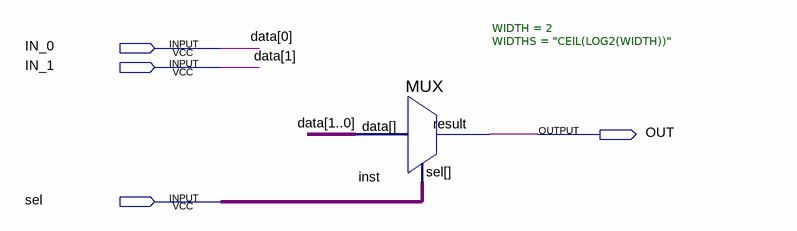
[diagram p0: schematic sheet]
// Quartus schematic mux2x1.bdf as structural Verilog: 1 symbols, 4 pins
module mux2x1 (
  input  IN_0,
  input  IN_1,
  input  sel,
  output OUT
);

  MUX #(.WIDTH(2), .WIDTHS("CEIL(LOG2(WIDTH))")) inst (.data({IN_1, IN_0}), .sel(sel), .result(OUT));

  // Other names for the same wires on the sheet: data[1:0] = {IN_1, IN_0}
endmodule
